# EAGLE design 5-Band 50W PA_50W PA (EAGLE 9.4.2)
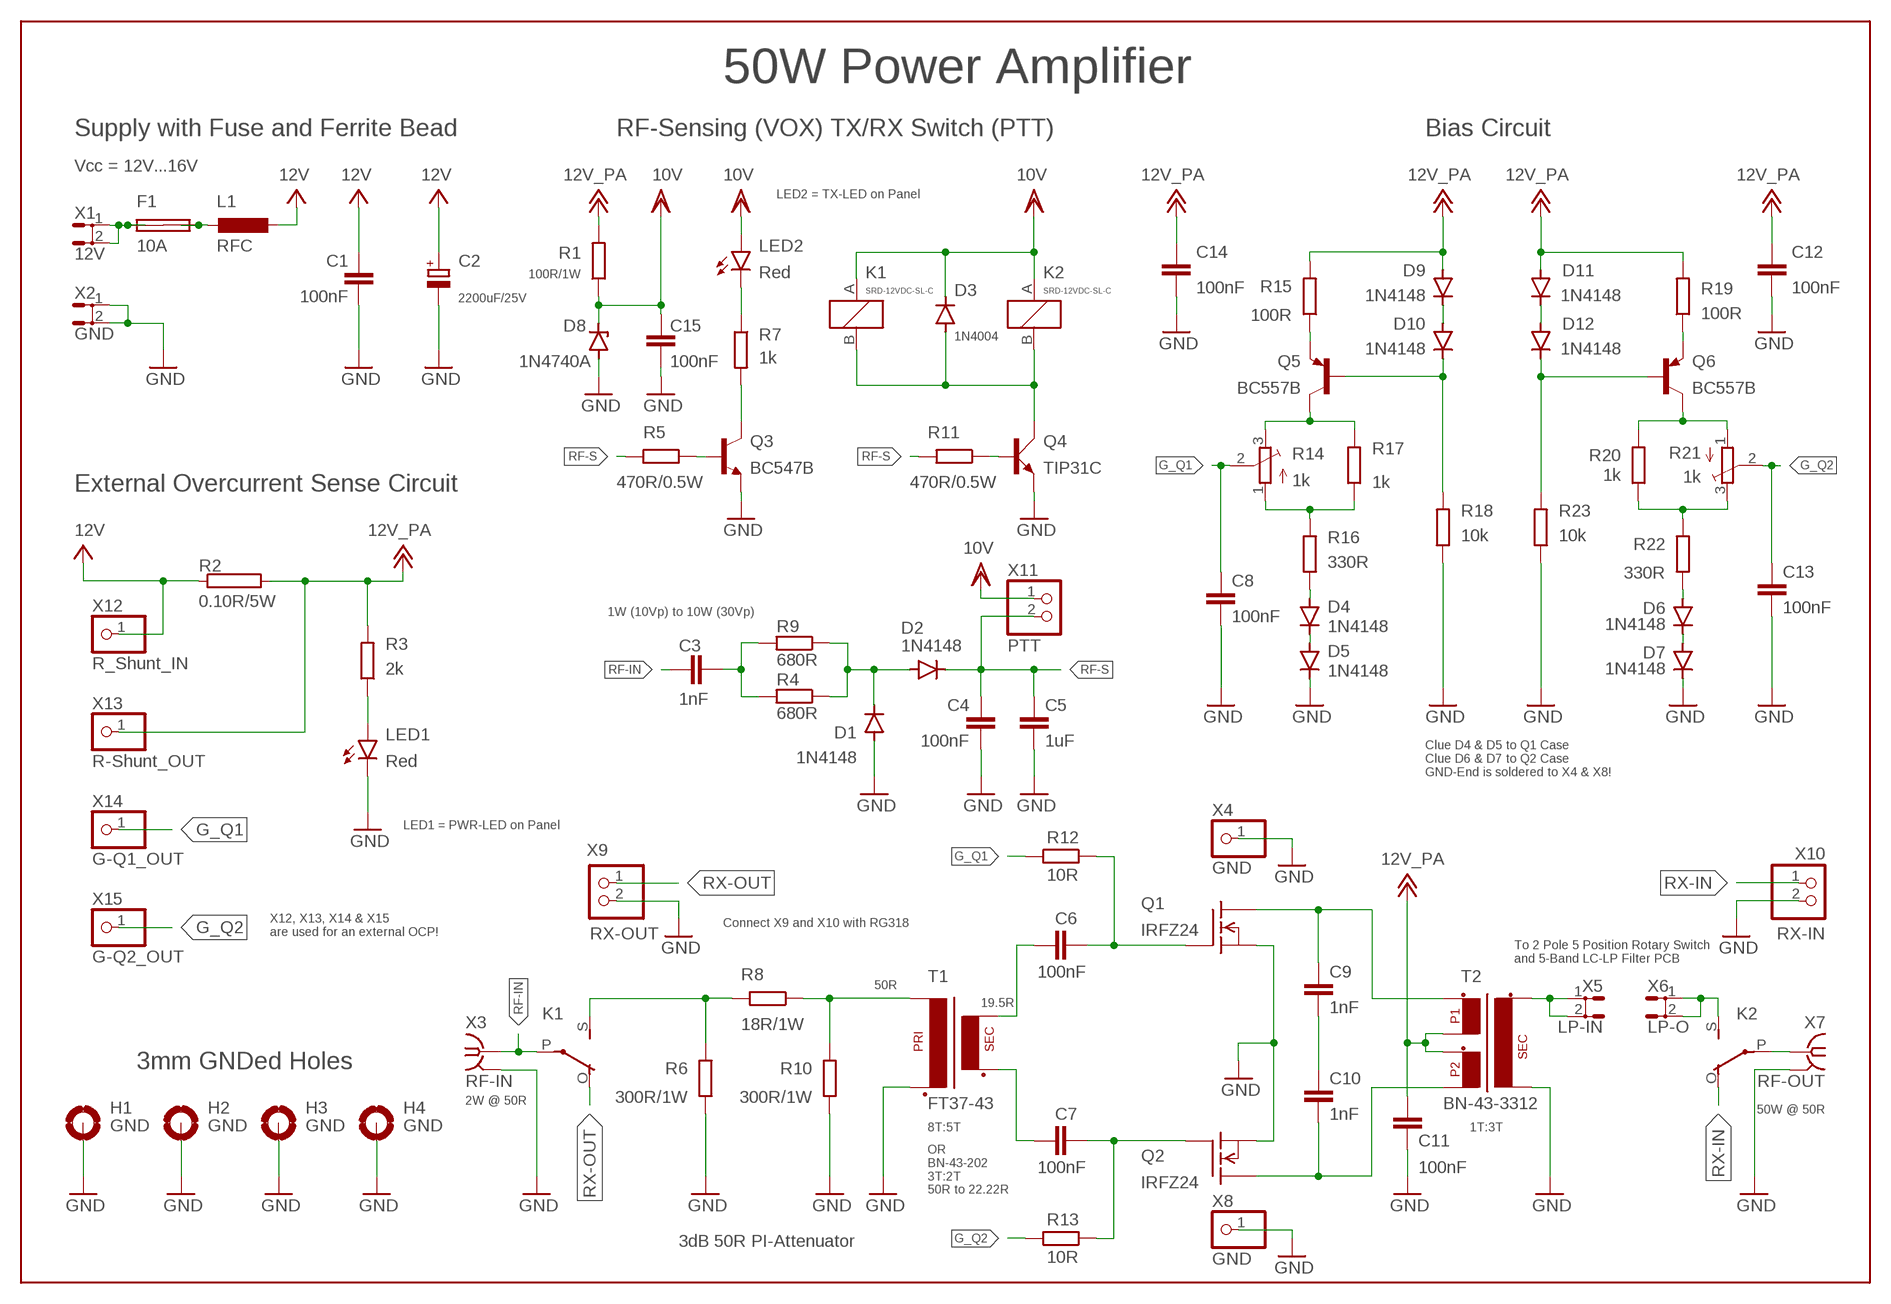
[diagram p0: schematic, sheet 1]

## Parts
C1  100nF  C-EUC0805  [C0805]
C2  2200uF/25V  CPOL-EUE7.5-16  [E7,5-16]
C3  1nF  C-EUC0805  [C0805]
C4  100nF  C-EUC0805  [C0805]
C5  1uF  C-EUC0805  [C0805]
C6  100nF  C-EUC0805  [C0805]
C7  100nF  C-EUC0805  [C0805]
C8  100nF  C-EUC0805  [C0805]
C9  1nF  C-EUC1206K  [C1206K]
C10  1nF  C-EUC1206K  [C1206K]
C11  100nF  C-EUC0805  [C0805]
C12  100nF  C-EUC0805  [C0805]
C13  100nF  C-EUC0805  [C0805]
C14  100nF  C-EUC0805  [C0805]
C15  100nF  C-EUC0805  [C0805]
D1  1N4148  DIODE-SOD323-W  [SOD323-W]
D2  1N4148  DIODE-SOD323-W  [SOD323-W]
D3  1N4004  [DO41-10]
D4  1N4148  1N4148DO35-7  [DO35-7]
D5  1N4148  1N4148DO35-7  [DO35-7]
D6  1N4148  1N4148DO35-7  [DO35-7]
D7  1N4148  1N4148DO35-7  [DO35-7]
D8  1N4740A  1N4728  [DO41Z10]
D9  1N4148  DIODE-SOD323-W  [SOD323-W]
D10  1N4148  DIODE-SOD323-W  [SOD323-W]
D11  1N4148  DIODE-SOD323-W  [SOD323-W]
D12  1N4148  DIODE-SOD323-W  [SOD323-W]
F1  10A  SHK20L  [SHK20L]
H1  GND  MOUNT-PAD-ROUND3.0  [3,0-PAD]
H2  GND  MOUNT-PAD-ROUND3.0  [3,0-PAD]
H3  GND  MOUNT-PAD-ROUND3.0  [3,0-PAD]
H4  GND  MOUNT-PAD-ROUND3.0  [3,0-PAD]
K1  SRD-12VDC-SL-C  [SRD-12VDC-SL-C]
K2  SRD-12VDC-SL-C  [SRD-12VDC-SL-C]
L1  RFC  T50-6  [T50-6SMD]
LED1  Red  LED5MM  [LED5MM]
LED2  Red  LED5MM  [LED5MM]
Q1  IRFZ24  IRF510  [TO220]
Q2  IRFZ24  IRF510  [TO220]
Q3  BC547B  BC547B-NPN-TO92-CBE  [TO92-CBE]
Q4  TIP31C  TIP41C  [TO220AV]
Q5  BC557B  [TO92-EBC]
Q6  BC557B  [TO92-EBC]
R1  100R/1W  R-EU_0414/15  [0414/15]
R2  0.10R/5W  RMNS-5  [MNS-5]
R3  2k  R-EU_R0805  [R0805]
R4  680R  R-EU_R0805  [R0805]
R5  470R/0.5W  R-EU_0207/10  [0207/10]
R6  300R/1W  R-EU_0414/15  [0414/15]
R7  1k  R-EU_R0805  [R0805]
R8  18R/1W  R-EU_0414/15  [0414/15]
R9  680R  R-EU_R0805  [R0805]
R10  300R/1W  R-EU_0414/15  [0414/15]
R11  470R/0.5W  R-EU_0207/10  [0207/10]
R12  10R  R-EU_0207/10  [0207/10]
R13  10R  R-EU_0207/10  [0207/10]
R14  1k  TRIM_EU-3223G  [3223G]
R15  100R  R-EU_R0805  [R0805]
R16  330R  R-EU_R0805  [R0805]
R17  1k  R-EU_R0805  [R0805]
R18  10k  R-EU_R0805  [R0805]
R19  100R  R-EU_R0805  [R0805]
R20  1k  R-EU_R0805  [R0805]
R21  1k  TRIM_EU-3223G  [3223G]
R22  330R  R-EU_R0805  [R0805]
R23  10k  R-EU_R0805  [R0805]
T1  FT37-43  [FT37-43SMD]
T2  BN-43-3312  BN-43-3312CENTERTAP  [BN-43-3312CENTERTAPSMD]
X1  12V  ST6,3  [ST6,3]
X2  GND  ST6,3  [ST6,3]
X3  RF-IN  SMA-PCB-CON142-0711-821/826  [J502-ND-142-0711-821/826]
X4  GND  PINHD-1X1  [1X01]
X5  LP-IN  ST6,3  [ST6,3]
X6  LP-O  ST6,3  [ST6,3]
X7  RF-OUT  SMA-PCB-CON142-0711-821/826  [J502-ND-142-0711-821/826]
X8  GND  PINHD-1X1  [1X01]
X9  RX-OUT  PINHD-1X2  [1X02]
X10  RX-IN  PINHD-1X2  [1X02]
X11  PTT  PINHD-1X2  [1X02]
X12  R_Shunt_IN  PINHD-1X1  [1X01]
X13  R-Shunt_OUT  PINHD-1X1  [1X01]
X14  G-Q1_OUT  PINHD-1X1  [1X01]
X15  G-Q2_OUT  PINHD-1X1  [1X01]

## Nets
+12V: C11.2 C12.2 C14.2 D9.A D11.A R1.2 R2.2 R3.2 R15.2 R19.2 T2.P$2(P1_2) T2.P$3(P2_1) X13.1 ; supply symbol labelled 12V_PA
G_Q1: C8.2 R12.2 R14.2(S) X14.1
G_Q2: C13.2 R13.2 R21.2(S) X15.1
GND: C1.1 C2.- C4.1 C5.1 C8.1 C11.1 C12.1 C13.1 C14.1 C15.1 D1.A D5.C D7.C D8.A H1.B3,0(MOUNT) H2.B3,0(MOUNT) H3.B3,0(MOUNT) H4.B3,0(MOUNT) LED1.K(C) Q1.3(S) Q2.3(S) Q3.E Q4.E R6.1 R10.1 R18.1 R23.1 T1.P$2(P2) T2.S$2(S2) X2.1 X2.2 X3.G@1(GND) X3.G@2(GND) X3.G@3(GND) X3.G@4(GND) X4.1 X7.G@1(GND) X7.G@2(GND) X7.G@3(GND) X7.G@4(GND) X8.1 X9.2 X10.2
N$1: C6.2 T1.S$1(S1)
N$2: C7.2 T1.S$2(S2)
N$3: LED2.K(C) R7.1
N$4: Q6.C R20.2 R21.1(A)
N$5: Q5.E R15.1
N$6: C9.1 Q1.2(D) T2.P$1(P1_1)
N$7: R20.1 R21.3(E) R22.2
N$8: C10.2 Q2.2(D) T2.P$4(P2_2)
N$9: K1.S R6.2 R8.2
N$10: K2.P X7.1(RF)
N$11: R8.1 R10.2 T1.P$1(P1)
N$13: D6.C D7.A
N$14: Q6.E R19.1
N$15: Q5.C R14.3(E) R17.2
N$16: D4.C D5.A
N$17: R14.1(A) R16.2 R17.1
N$18: D4.A R16.1
N$19: D6.A R22.1
N$20: D10.C Q5.B R18.2
N$21: C6.1 Q1.1(G) R12.1
N$22: C7.1 Q2.1(G) R13.1
N$23: K2.S X6.1 X6.2
N$24: D3.A K1.B(1:B) K2.B(1:B) Q4.C
N$25: D1.C D2.A R4.1 R9.1
N$26: D12.C Q6.B R23.2
N$27: Q4.B R11.1
N$28: F1.1A F1.1B X1.1 X1.2
N$30: F1.2A F1.2B L1.P$1
N$31: D9.C D10.A
N$32: Q3.C R7.2
N$33: Q3.B R5.1
N$34: C3.1 R4.2 R9.2
N$36: C9.2 C10.1
N$37: LED1.A R3.1
N$39: T2.S$1(S1) X5.1 X5.2
N$40: D11.C D12.A
RF-IN: C3.2 K1.P X3.1(RF)
RF-S: C4.2 C5.2 D2.C R5.2 R11.2 X11.2
RX-IN: K2.O X10.1
RX-OUT: K1.O X9.1
VCC: C1.2 C2.+ L1.P$2 R2.1 X12.1 ; supply symbol labelled 12V
VDD: C15.2 D3.C D8.C K1.A(1:A) K2.A(1:A) LED2.A R1.1 X11.1 ; supply symbol labelled 10V

## Notes on the sheet
- 50W Power Amplifier
- Supply with Fuse and Ferrite Bead | RF-Sensing (VOX) TX/RX Switch (PTT) | Bias Circuit
- Vcc = 12V...16V
- LED2 = TX-LED on Panel
- External Overcurrent Sense Circuit
- 1W (10Vp) to 10W (30Vp)
- Clue D4 & D5 to Q1 Case
  Clue D6 & D7 to Q2 Case
  GND-End is soldered to X4 & X8!
- LED1 = PWR-LED on Panel
- Connect X9 and X10 with RG318
- X12, X13, X14 & X15 
  are used for an external OCP!
- To 2 Pole 5 Position Rotary Switch 
  and 5-Band LC-LP Filter PCB
- 50R
- 19.5R
- 3mm GNDed Holes
- 2W @ 50R | 50W @ 50R
- 8T:5T | 1T:3T
- OR
  BN-43-202
  3T:2T
  50R to 22.22R
- 3dB 50R PI-Attenuator

## Library data of the parts
C1 C3-C15 = rcl:C-EU: CAPACITOR, European symbol; SPICEPREFIX: C
C2 = rcl:CPOL-EU: POLARIZED CAPACITOR, European symbol; SPICEPREFIX: C
D1 D2 D9-D12 = diode:DIODE-: DIODE
D3 = diode:1N4004: DIODE general purpose rectifier, 1 A
D4-D7 = diode:1N4148: DIODE high speed (Philips)
D8 = diode:1N4728: Z DIODE 3.3 V, 1W, 5 percent
F1 = fuse:SHK20L: FUSE HOLDER 5 x 20 mm, SH contact, SHH1 Schukat, E1073 Buerklin; OC_FARNELL: unknown; OC_NEWARK: unknown
H1-H4 = holes:MOUNT-PAD-ROUND: MOUNTING PAD, round
K1 K2 = Ham Radio:SRD-12VDC-SL-C: RELAY horizontal, 1 x switch, 5 A/300 V DC, 250 V AC, Siemens
L1 = Ham Radio:T50-6
LED1 LED2 = led:LED: LED OSRAM: - CHIPLED LG R971, LG N971, LY N971, LG Q971, LY Q971, LO R971, LY R971 LH N974, LH R974 LS Q976, LO Q976, LY Q976 LO Q996 - Hyper CHIPLED LW Q18S LB Q993, LB Q99A, LB R99A - SideLED LS A670, LO A670, LY A670, LG A670, LP A670 LB A673, LV A673, LT A673, LW A673 LH A674 LY A675 LS A676, LA A676, LO A676, LY A676, LW A676 LS A679, LY A679, LG A679 - Hyper Micro SIDELED® LS Y876, LA Y876, LO Y876, LY Y876 LT Y87S - SmartLED LW L88C, LW L88S LB L89C, LB L89S, LG L890 LS L89K, LO L89K, LY L89K LS L896, LA L896, LO L896, LY L896 - TOPLED LS T670, LO T670, LY T670, LG T670, LP T670 LSG T670, LSP T670, LSY T670, LOP T670, LYG T670 LG T671, LOG T671, LSG T671 LB T673, LV T673, LT T673, LW T673 LH T674 LS T676, LA T676, LO T676, LY T676, LB T676, LH T676, LSB T676, LW T676 LB T67C, LV T67C, LT T67C, LS T67K, LO T67K, LY T67K, LW E67C LS E67B, LA E67B, LO E67B, LY E67B, LB E67C, LV E67C, LT E67C LW T67C LS T679, LY T679, LG T679 LS T770, LO T770, LY T770, LG T770, LP T770 LB T773, LV T773, LT T773, LW T773 LH T774 LS E675, LA E675, LY E675, LS T675 LS T776, LA T776, LO T776, LY T776, LB T776 LHGB T686 LT T68C, LB T68C - Hyper Mini TOPLED® LB M676 - Mini TOPLED Santana® LG M470 LS M47K, LO M47K, LY M47K Source: http://www.osram.convergy.de LUXEON: - LUMILED® LXK2-PW12-R00, LXK2-PW12-S00, LXK2-PW14-U00, LXK2-PW14-V00 LXK2-PM12-R00, LXK2-PM12-S00, LXK2-PM14-U00 LXK2-PE12-Q00, LXK2-PE12-R00, LXK2-PE12-S00, LXK2-PE14-T00, LXK2-PE14-U00 LXK2-PB12-K00, LXK2-PB12-L00, LXK2-PB12-M00, LXK2-PB14-N00, LXK2-PB14-P00, LXK2-PB14-Q00 LXK2-PR12-L00, LXK2-PR12-M00, LXK2-PR14-Q00, LXK2-PR14-R00 LXK2-PD12-Q00, LXK2-PD12-R00, LXK2-PD12-S00 LXK2-PH12-R00, LXK2-PH12-S00 LXK2-PL12-P00, LXK2-PL12-Q00, LXK2-PL12-R00 Source: www.luxeon.com KINGBRIGHT: KA-3528ASYC Source: www.kingbright.com
Q1 Q2 = transistor-fet:IRF510: N-Channel Enhancement MOSFET (HEXFET); 100V; 5,6A; 0,54Ohm
Q3 = transistor:*-NPN-: NPN Transistror BF959 corrected 2008.03.06
Q4 = transistor-power:TIP41C: NPN TRANSISTOR
Q5 Q6 = transistor-pnp:BC557*: PNP Transistror
R1 R3-R13 R15-R20 R22 R23 = rcl:R-EU_: RESISTOR, European symbol; SPICEPREFIX: R
R2 = resistor-power:R: Power Resitor; OC_FARNELL: unknown; OC_NEWARK: unknown
R14 R21 = pot:TRIM_EU-: POTENTIOMETER
T1 = Ham Radio:FT37-43
T2 = Ham Radio:BN-43-3312CENTERTAP
X1 X2 X5 X6 = con-rib:ST6,3: RIBBON CABLE CONNECTOR Flachstecker / Faston; OC_FARNELL: unknown; OC_NEWARK: unknown
X3 X7 = Ham Radio:SMA-PCB-CON: SMA 50 Ohm End Launch Jack Receptacle - Round Contact Johnson Components Source: www.johnsoncomponents.com .. J502-ND.pdf; MF: JOHNSON COMPONENTS; MPN: 142-0711-821; OC_FARNELL: 1019328; OC_NEWARK: 16F3627
X4 X8 X12-X15 = pinhead:PINHD-1X1: PIN HEADER
X9-X11 = pinhead:PINHD-1X2: PIN HEADER

## Board
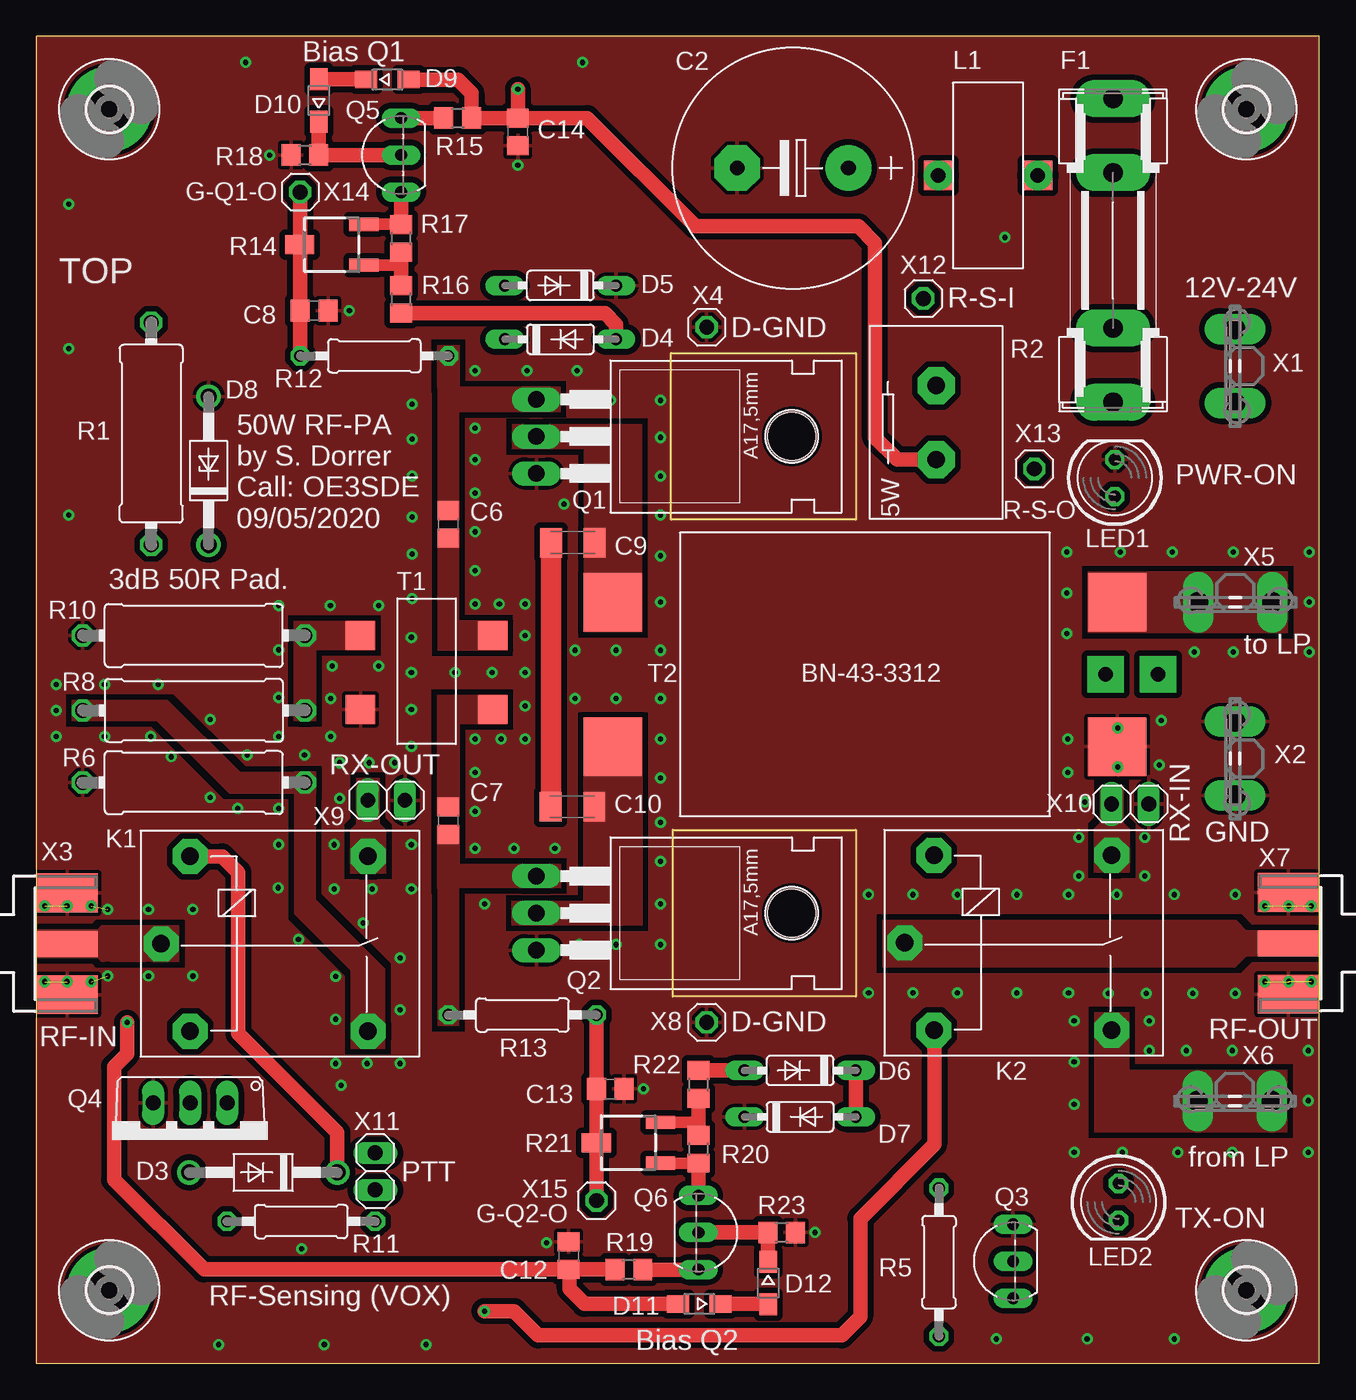
[diagram p1: board, top side]
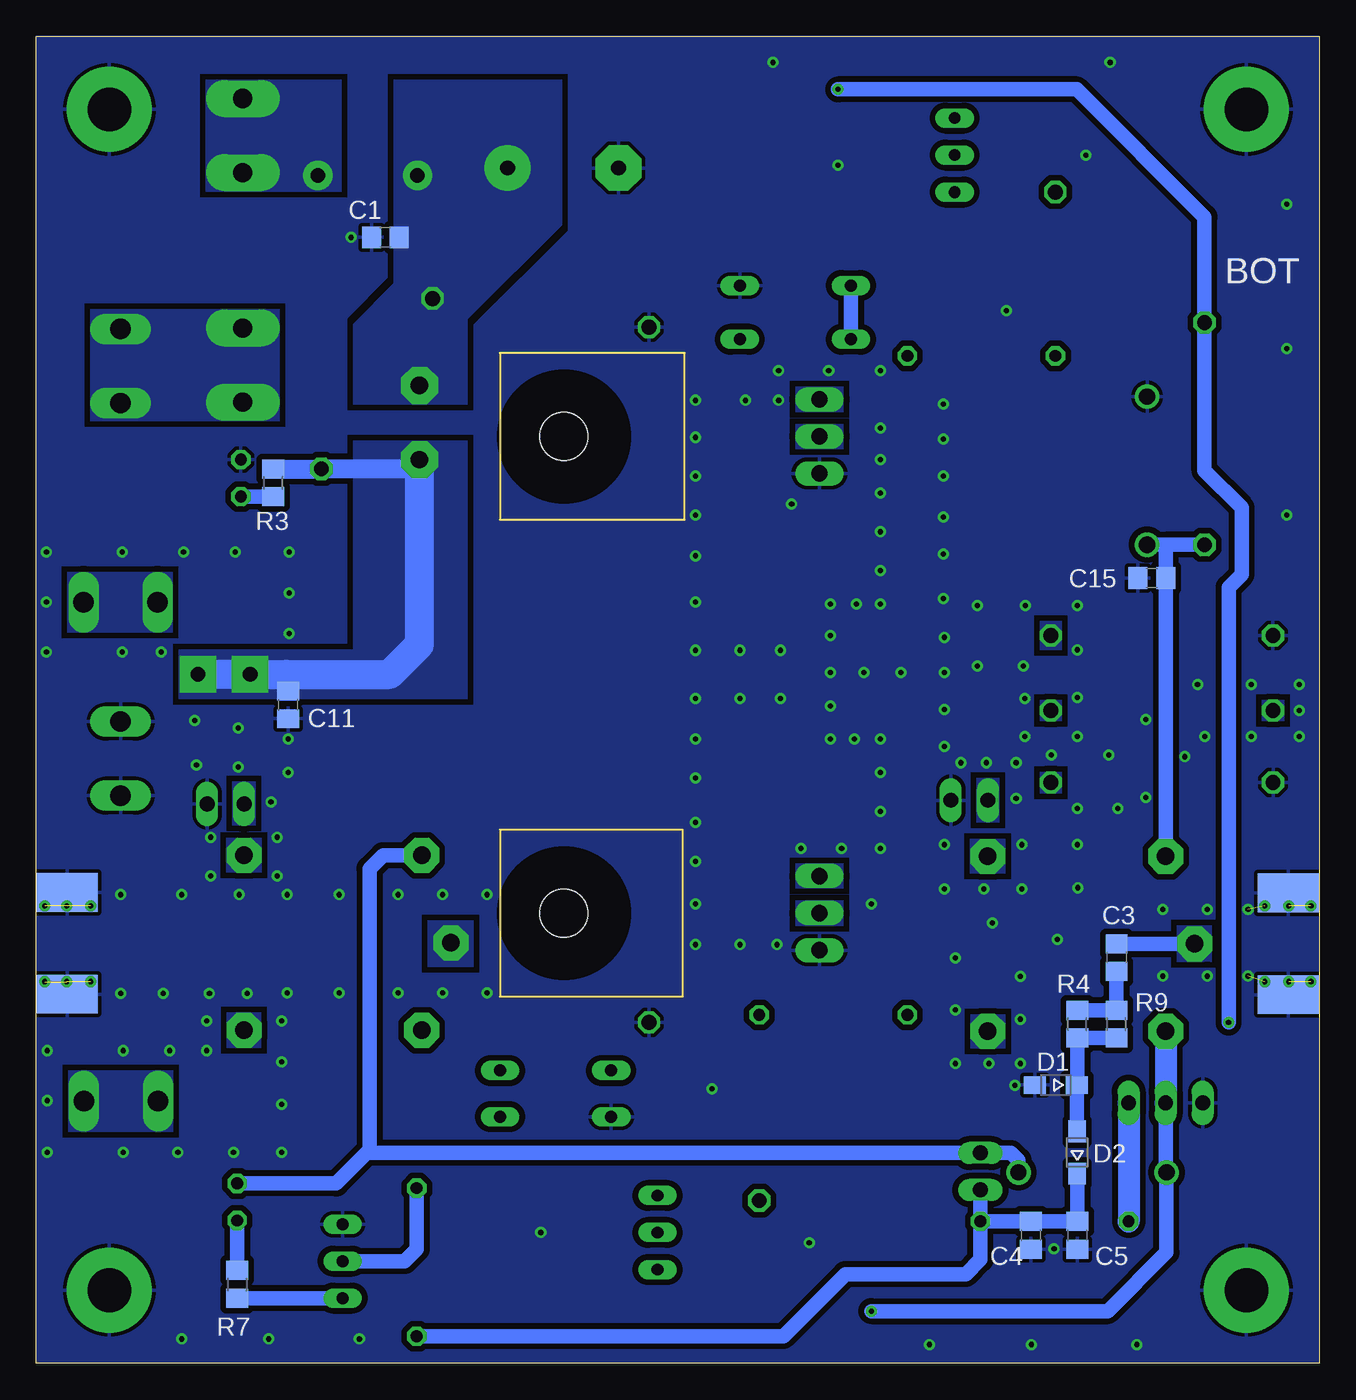
[diagram p2: board, bottom side, seen from below]

Size 88 x 91 mm. Coordinates in mm from the lower left corner, seen from the top.
Outline: 0,0 88,0 88,91 0,91 0,0
Copper layers (1*16): Top 0.035mm / dielectric 1.5mm / Bottom 0.035mm
Design rules "default *": minimum track width 6mil, minimum drill 0.35mm, track to track 6mil, track to pad 6mil, pad to pad 6mil, via to via 6mil, smd to smd 6mil, copper to edge 0mil, drill to drill 6mil, minimum pad ring 10mil, minimum via ring 8mil, stop-mask expansion 4mil, vias tented up to drill 0mil, thermal gap 10mil
Milling: 8 lines

### Footprints (pad centres in the part's own frame; a part is rotated, then mirrored left to right if it is on the bottom)
C0805 = smd 1.3 x 1.5: 1 -0.95,0; 2 0.95,0
E7,5-16 = drill 1.016 pad 3.15: + -3.81,0 | drill 1.016 pad 3.15 octagon: - 3.81,0
C1206K = smd 1.5 x 2: 1 -1.5,0; 2 1.5,0
SOD323-W = smd 1.5 x 1.2: A 1.45,0; C -1.45,0
DO41-10 = drill 1.118: A 5.08,0; C -5.08,0
DO35-7 = drill 0.813 long: A 3.81,0; C -3.81,0
DO41Z10 = drill 1.118: A 5.08,0; C -5.08,0
SHK20L = drill 1.321 pad 2.54 long: 1A -10.414,0; 1B -5.334,0; 2A 10.414,0; 2B 5.334,0
3,0-PAD = drill 3 pad 5.842: B3,0 0,0
SRD-12VDC-SL-C = drill 1.2 pad 2.4 octagon: A -5.998,6.13; B -5.998,-5.87; O 6.202,6.13; P -7.998,0.13; S 6.202,-5.87
T50-6SMD = smd 2 x 2: P$1 -3.54,0; P$2 3.29,0
LED5MM = drill 0.813 octagon: A -1.27,0; K 1.27,0
TO220 = drill 1.118 long: 1 -2.54,-6.35; 2 0,-6.35; 3 2.54,-6.35 | hole 3.302: 0,11.176
TO92-CBE = drill 0.813 long: B 0,0; C -2.54,0; E 2.54,0
TO220AV = drill 1.016 long: B -2.54,-2.54; C 0,-2.54; E 2.54,-2.54
TO92-EBC = drill 0.813 long: B 0,-1.27; C -2.54,-1.27; E 2.54,-1.27
0414/15 = drill 1.016 octagon: 1 -7.62,0; 2 7.62,0
MNS-5 = drill 1.194 pad 2.54 octagon: 1 -2.54,0; 2 2.54,0
R0805 = smd 1.3 x 1.5: 1 -0.95,0; 2 0.95,0
0207/10 = drill 0.813 octagon: 1 -5.08,0; 2 5.08,0
3223G = smd 2 x 0.9: 1 -2.2,1.4; 3 -2.2,-1.4 | smd 2 x 1.3: 2 2.2,0
FT37-43SMD = smd 2 x 2: P$1 -5.08,0; P$2 -5.08,-5.08; S$1 4,0; S$2 4,-5.08
BN-43-3312CENTERTAPSMD = smd 4 x 4: P$1 -4.6,14.675; P$4 -4.6,4.775; S$1 30,14.675; S$2 30,4.775 | drill 1 pad 2.5 square: P$2 29.21,9.725; P$3 32.794,9.725
ST6,3 = drill 1.397 long: 1 -2.54,0; 2 2.54,0
J502-ND-142-0711-821/826 = smd 4.191 x 1.778: 1 2.115,0 | smd 4.191 x 2.667: G@1 2.115,3.495; G@2 2.115,-3.495 | smd 4.191 x 2.667 bottom: G@3 2.115,3.495; G@4 2.115,-3.495
1X01 = drill 1.016 octagon: 1 0,0
1X02 = drill 1.016 long: 1 -1.27,0; 2 1.27,0

### Placement (x,y rotation side)
C1  64.07,77.22 0 bottom
C2  51.88,81.98 180 top
C3  13.91,27.81 90 bottom
C4  19.78,8.76 90 bottom
C5  16.61,8.76 90 bottom
C6  28.26,57.53 270 top
C7  28.26,37.21 90 top
C8  19.05,72.2 180 top
C9  36.79,56.27 180 top
C10  36.77,38.16 0 top
C11  70.74,45.15 90 bottom
C12  36.51,7.37 270 top
C13  39.37,18.8 180 top
C14  33.02,84.45 90 top
C15  11.49,53.85 0 bottom
D1  18.07,19.07 180 bottom
D2  16.61,14.45 90 bottom
D3  15.56,13.08 180 top
D4  35.94,70.23 0 top
D5  35.94,73.91 180 top
D6  52.39,20.07 180 top
D7  52.39,16.89 0 top
D8  11.81,61.21 90 top
D9  24.07,88.04 0 top
D10  19.37,86.61 90 top
D11  45.47,4.06 180 top
D12  50.2,5.49 270 top
F1  73.85,76.33 90 top
H1  83,86 0 top
H2  83,5 0 top
H3  5,5 0 top
H4  5,86 0 top
K1  16.54,28.64 0 top
K2  67.56,28.7 0 top
L1  65.15,81.47 180 top
LED1  73.98,60.71 90 top
LED2  74.23,11.05 270 top
Q1  40.64,63.56 270 top
Q2  40.64,30.86 270 top
Q3  66.99,6.99 90 top
Q4  10.54,15.3 180 top
Q5  23.75,82.87 90 top
Q6  46.67,8.95 270 top
R1  7.87,63.75 90 top
R2  61.72,64.52 270 top
R3  71.75,60.39 90 bottom
R4  16.61,23.24 90 bottom
R5  61.91,6.92 270 top
R6  10.79,39.82 0 top
R7  74.23,5.4 270 bottom
R8  10.79,44.77 180 top
R9  13.91,23.24 90 bottom
R10  10.79,49.91 0 top
R11  18.16,9.72 0 top
R12  23.18,69.09 180 top
R13  33.34,23.88 0 top
R14  20.26,76.71 180 top
R15  28.89,85.41 0 top
R16  25.02,72.96 90 top
R17  25.02,77.15 90 top
R18  18.41,82.87 0 top
R19  40.64,6.41 180 top
R20  45.4,14.67 270 top
R21  40.61,15.11 180 top
R22  45.4,19.11 270 top
R23  51.12,8.95 180 top
T1  27.3,49.91 0 top
T2  44.13,37.51 0 top
X1  82.23,68.39 270 top
X2  82.23,41.47 270 top
X3  0,28.77 0 top
X4  45.97,71.06 0 top
X5  82.23,52.2 0 top
X6  82.2,17.97 0 top
X7  88,28.8 180 top
X8  45.97,23.37 0 top
X9  24,38.61 0 top
X10  75.03,38.35 0 top
X11  23.24,13.14 270 top
X12  60.83,73.03 0 top
X13  68.45,61.34 0 top
X14  18.1,80.33 0 top
X15  38.42,11.14 0 top

### Tracks (layer width: path | path; a pad name or v marks a point on that pad's centre or on a via)
+12V  (via drill 0.35)
  Top 1: C12.2 36.58,6.35 36.58,5.08 37.59,4.06 D11.A | R2.2 59.05,61.98 57.53,63.5 57.53,76.83 56.39,77.98 45.21,77.98 37.78,85.41 C14.2 | C12.2 11.49,6.42 5.33,12.57 5.33,20.32 6.22,21.21 v6.22,23.37 | C12.2 R19.2 | D9.A 28.92,88.04 29.84,87.12 R15.2 C14.2 | v33.02,87.38 C14.2
  Bottom 1: C11.2 70.74,47.11 70.87,47.24 | v33.02,87.38 16.65,87.38 7.87,78.6 R1.2 7.87,61.21 5.33,58.67 5.33,54.1 6.22,53.21 v6.22,23.37
  Bottom 1.3: R3.2 X13.1 62.36,61.34 R2.2
  Bottom 2: R2.2 61.72,49.28 63.76,47.24 70.87,47.24 T2.P$2 T2.P$3
  pour Bottom (isolate 0.6, no thermals): 58.42,63.25 66.29,63.25 66.29,48.9 78.23,48.9 78.23,45.59 58.42,45.59
G_Q1
  Top 1: R12.2 C8.2 18.1,76.67 R14.2 18.1,76.75 X14.1
G_Q2
  Top 1: 38.42,15.12 R21.2 | R13.2 C13.2 38.42,15.12 | X15.1 38.42,15.12
GND  (via drill 0.35)  (8 unrouted)
  other vias: 20.89,19.05 77.15,44.07 70.68,55.63 74.36,55.63 77.91,55.63 82.11,55.63 79.44,48.77 70.68,50.04 70.68,52.83 70.8,32.13 74.1,32.13 78.04,32.13 82.23,32.13 70.74,42.8 70.74,40.51 67.25,32.13 57.09,32.13 63.18,32.13 57.09,25.4 60.13,32.13 84.26,31.37 85.92,31.37 87.44,31.37 84.26,26.16 85.92,26.16 87.44,26.16 3.75,31.37 2.1,31.37 0.57,31.37 3.75,26.16 2.1,26.16 0.57,26.16 4.89,31.11 7.68,31.11 10.73,31.11 10.73,26.54 7.68,26.54 4.89,26.54 76.14,25.37 60.13,25.4 63.18,25.4 67.25,25.4 70.8,25.4 79.31,25.37 82.23,25.37 73.53,25.37 25.72,32.51 25.72,35.56 25.72,42.29 20.29,47.82 25.78,55.5 25.78,52.45 33.53,45.09 33.53,47.37 31.24,47.37 30.1,42.8 33.53,42.8 28.7,47.37 25.72,47.37 25.72,44.83 30.1,40.51 30.1,35.31 32.77,35.31 35.56,35.31 30.73,31.5 30.1,37.85 25.72,49.78 25.78,58.04 25.78,60.83 25.78,63.37 25.78,65.79 33.53,49.91 33.53,52.07 30.1,52.07 31.75,52.07 30.1,54.36 30.1,57.02 30.1,59.69 30.1,61.98 30.1,64.14 31.88,42.8 30.1,68.07 37.08,66.04 37.08,68.07 33.66,68.07 36.96,48.9 39.75,48.9 42.8,48.9 39.37,66.04 42.8,63.5 42.8,66.04 42.8,58.17 42.8,52.2 42.8,55.37 42.8,60.83 42.8,45.59 39.75,45.59 36.96,45.59 42.8,42.8 42.8,40.13 42.8,37.08 42.8,34.42 42.8,31.5 37.21,28.7 39.75,28.7 42.8,28.7 36.2,58.93 12.51,1.27 19.75,1.27 26.73,1.27 65.85,1.65 72.07,1.65 78.04,1.65 18.19,7.84 16,82.87 33.02,82.17 53.4,8.95 41.66,18.8 34.99,8.26 2.22,79.5 2.22,69.6 2.22,58.17 77.03,41.02 23.02,32.51 20.42,35.56 20.42,32.51 20.8,38.73 22.83,41.18 24.57,41.18 22.67,20.54 20.51,20.54 24.96,20.54 24.96,24.23 24.96,27.78 22.42,30.19 20.51,23.59 20.51,26.51 16.57,32.61 17.97,29.05 16.61,38.04 16.61,35.56 18.38,41.72 16.61,45.66 23.46,47.82 20.19,45.59 16.61,42.99 20.19,42.99 20.8,41.18 16.61,48.93 16.61,51.97 20.16,51.97 23.46,51.97 7.84,42.99 1.37,42.99 4.67,42.99 1.37,46.55 1.37,44.77 4.67,46.55 8.35,46.55 14.45,41.72 11.91,44.13 11.91,38.8 9.24,41.59 71.5,36.07 71.5,33.4 71.91,38.48 76.04,36.07 76.04,33.4 74.17,43.56 74.17,40.89 76.33,21.43 76.33,23.46 71.18,23.46 71.18,14.45 71.18,17.75 71.18,20.67 78.87,21.43 82.04,21.43 74.49,14.45 78.3,14.45 87.31,55.63 87.31,52.2 82.11,48.77 87.25,21.43 87.25,14.45 82.04,14.45 66.42,77.22 13.81,38.04 14.35,89.22 21.46,72.2 37.47,89.22 87.31,48.77 87.25,18
  pour Top (isolate 0.4, rank 3): 0,0 0,91 88,91 88,0
  pour Bottom (isolate 0.4, rank 2): 0,0 0,91 88,91 88,0
N$1
  pour Top (isolate 0.6, no thermals): 27.53,57.21 27.53,48.93 32.29,48.93 32.29,50.9 28.99,50.9 28.99,57.21
N$2
  pour Top (isolate 0.6, no thermals): 27.53,37.53 27.53,45.82 32.29,45.82 32.29,43.85 28.99,43.85 28.99,37.53
N$3
  Bottom 1: LED2.K R7.1
N$4
  Top 0.8: R21.1 R20.2
  Top 1: Q6.C R20.2
N$5
  Top 1: R15.1 Q5.E
N$6
  pour Top (isolate 0.8, no thermals): 41.53,50.2 41.53,64.39 32.64,64.39 32.64,62.74 37.56,62.74 37.56,50.2
  pour Bottom (isolate 0.6, no thermals): 35.94,64.39 35.94,62.74 32.64,62.74 32.64,64.39
N$7
  Top 0.8: R21.3 45.4,16.51
  Top 1: R22.2 45.4,16.51 R20.1
N$8
  pour Top (isolate 0.8, no thermals): 32.64,31.69 37.56,31.69 37.56,44.26 41.53,44.26 41.53,30.04 32.64,30.04
  pour Bottom (isolate 0.6, no thermals): 35.94,31.69 35.94,30.04 32.64,30.04 32.64,31.69
N$9
  pour Bottom (isolate 0.6, no thermals): 2.44,45.5 2.44,44.04 3.91,44.04 3.91,45.5
  pour Bottom (isolate 0.6, no thermals): 17.68,40.54 17.68,39.08 19.15,39.08 19.15,40.54
  pour Top (isolate 0.6, no thermals): 21.56,21.59 23.91,21.59 23.91,27.02 19.15,31.78 19.15,40.54 17.68,40.54 17.68,30.83 21.56,26.96
  pour Bottom (isolate 0.6, no thermals): 21.56,23.91 21.56,21.59 23.91,21.59 23.91,23.91
  pour Top (isolate 0.6, no thermals): 19.15,39.08 13.24,39.08 8.29,44.04 2.44,44.04 2.44,45.5 8.99,45.5 13.94,40.54 19.15,40.54
N$10
  pour Top (isolate 1.27, no thermals): 88.01,29.65 82.99,29.65 82.3,30.35 58.04,30.35 58.04,27.18 82.23,27.18 82.99,27.94 88.01,27.94
  pour Bottom (isolate 1.27, no thermals): 58.04,30.35 58.04,27.18 61.15,27.18 61.15,30.35
N$11
  pour Top (isolate 0.6, no thermals): 19.15,44.04 17.68,44.04 17.68,50.9 23.21,50.9 23.21,48.93 19.15,48.93
  pour Bottom (isolate 0.6, no thermals): 17.68,45.5 17.68,44.04 19.15,44.04 19.15,45.5
  pour Bottom (isolate 0.6, no thermals): 17.68,50.9 17.68,48.93 19.15,48.93 19.15,50.9
N$13
  Top 1: D6.C D7.A
N$14
  Top 1: R19.1 Q6.E
N$15
  Top 0.8: R14.3 R17.2
  Top 1: Q5.C R17.2
N$16
  Bottom 1: D5.A D4.C
N$17
  Top 0.8: R14.1 25.02,75.31
  Top 1: R17.1 25.02,75.31 R16.2
N$18
  Top 1: D4.A 39.75,71.25 38.99,72.01 R16.1
N$19
  Top 1: R22.1 D6.A
N$20
  Top 1: Q5.B R18.2 D10.C
N$21
  pour Top (isolate 0.6, no thermals): 27.53,57.85 28.99,57.85 28.99,65.28 35.94,65.28 35.94,66.93 27.53,66.93
  pour Top (isolate 0.6, no thermals): 27.53,66.93 27.53,69.82 28.99,69.82 28.99,66.93
  pour Bottom (isolate 0.6, no thermals): 35.94,66.93 35.94,65.28 32.64,65.28 32.64,66.93
N$22
  pour Top (isolate 0.6, no thermals): 27.53,36.89 28.99,36.89 28.99,34.23 35.94,34.23 35.94,32.58 27.53,32.58
  pour Top (isolate 0.6, no thermals): 27.53,32.58 27.53,23.15 28.99,23.15 28.99,32.58
  pour Bottom (isolate 0.6, no thermals): 35.94,34.23 35.94,32.58 32.64,32.58 32.64,34.23
N$23
  pour Bottom (isolate 0.9, no thermals): 78.64,20.07 78.64,15.88 85.79,15.88 85.79,20.07
  pour Top (isolate 0.9, no thermals): 72.58,24 72.58,15.88 85.79,15.88 85.79,20.07 74.96,20.07 74.96,24
  pour Bottom (isolate 0.9, no thermals): 72.58,24 74.96,24 74.96,21.65 72.58,21.65
N$24  (via drill 0.35)
  Top 1: K2.B 61.59,22.8 61.59,14.99 56.52,9.91 56.52,3.17 55.24,1.91 34.42,1.91 32.77,3.56 v30.73,3.56
  Bottom 1: v30.73,3.56 14.51,3.56 10.48,7.59 D3.A 10.54,13.14 Q4.C
  Bottom 1.5: K1.B Q4.C
N$25
  Bottom 1: R9.1 R4.1 16.61,19.08 D1.C 16.62,15.91 D2.A
N$26
  Top 1: Q6.B R23.2 50.17,6.97 D12.C
N$27
  Bottom 1.5: Q4.B R11.1
N$28
  pour Bottom (isolate 0.8, no thermals): 71.31,72.26 84.3,72.26 84.3,64.64 71.31,64.64
N$30  (via drill 1 pad 2)
  Bottom 1: L1.P$1 68.71,81.49 68.71,81.53
  other vias: 68.69,81.47
  pour Bottom (isolate 0.8, no thermals): 67.06,88.01 76.39,88.01 76.39,80.39 67.06,80.39
N$31
  Top 1: D10.A 22.59,88.06 D9.C
N$32
  Bottom 1: Q3.C R7.2
N$33
  Bottom 1: R5.1 61.91,7.81 62.74,6.99 Q3.B
N$34
  Bottom 1: C3.1 R9.2 R4.2
N$36
  Top 1.4: C9.2 35.29,38.19 C10.1
N$37
  Bottom 1: R3.1 LED1.A
N$39
  pour Top (isolate 0.9, no thermals): 72.14,50.1 85.85,50.1 85.85,54.26 72.14,54.26
  pour Bottom (isolate 0.9, no thermals): 78.68,54.26 78.68,50.1 85.85,50.1 85.85,54.26
N$40
  Top 1: D11.C 50.17,4.06 D12.A
RF-IN
  Bottom 1: C3.2 K1.P
  pour Top (isolate 0.6, no thermals): 0,27.81 4.19,27.81 4.45,27.56 9.78,27.56 9.78,29.97 4.45,29.97 4.19,29.72 0,29.72
  pour Bottom (isolate 0.6, no thermals): 9.78,29.97 9.78,27.56 7.37,27.56 7.37,29.97
RF-S
  Bottom 1: R5.2 36.77,1.84 32.51,6.1 24.26,6.1 23.24,7.11 R11.2 | D2.C C5.2 C4.2 R11.2 | X11.2 R11.2
RX-IN
  pour Top (isolate 0.6, no thermals): 72.58,33.66 72.58,36.64 72.99,37.05 72.99,39.88 74.52,39.88 74.52,37.08 74.96,36.64 74.96,33.66
  pour Bottom (isolate 0.6, no thermals): 72.58,36 72.58,33.66 74.96,33.66 74.96,36
  pour Bottom (isolate 0.6, no thermals): 72.99,36.86 74.55,36.86 74.55,39.88 72.99,39.88
RX-OUT
  pour Top (isolate 0.6, no thermals): 21.56,33.59 21.56,36.58 21.97,36.99 21.97,40.13 23.5,40.13 23.5,37.02 23.94,36.58 23.94,33.59
  pour Bottom (isolate 0.6, no thermals): 21.56,35.94 21.56,33.59 23.94,33.59 23.94,35.94
  pour Bottom (isolate 0.6, no thermals): 21.97,40.13 21.97,37.08 23.5,37.08 23.5,40.13
VCC  (via drill 1 pad 2)
  Bottom 1: L1.P$2 61.86,81.52 61.85,81.53
  other vias: 61.86,81.47
  pour Bottom (isolate 0.8, no thermals): 63.5,80.39 51.94,80.39 51.94,88.01 63.5,88.01
  pour Bottom (isolate 0.8, no thermals): 58.42,65.79 58.42,71.63 51.94,78.11 51.94,80.39 63.5,80.39 63.5,74.04 66.29,71.25 66.29,65.79
VDD
  Top 1: K1.A 12.73,34.77 13.84,33.66 13.84,22.61 20.64,15.81 D3.C
  Bottom 1: K2.A 64.23,34.83 65.15,33.91 65.15,14.61 65.34,14.41 | LED2.A 67.44,12.32 65.34,14.41 | 65.34,14.41 X11.1 21.14,14.41 20.64,13.91 D3.C | D8.C 10.54,56.13 | K1.A C15.2 10.54,56.13 | R1.1 10.54,56.13

### Text on the board
tNames: Bias Q1 | G-Q1-O | TOP | 12V-24V | R-S-I | D-GND | PWR-ON | R-S-O | 50W RF-PA / by S. Dorrer / Call: OE3SDE / 09/05/2020 | 3dB 50R Pad. | to LP | BN-43-3312 | RX-OUT | RX-IN | GND | D-GND | RF-IN | RF-OUT | from LP | PTT | G-Q2-O | TX-ON | RF-Sensing (VOX) | Bias Q2
bNames: BOT